# EAGLE design MISTERCRT_Final (EAGLE 9.6.2)
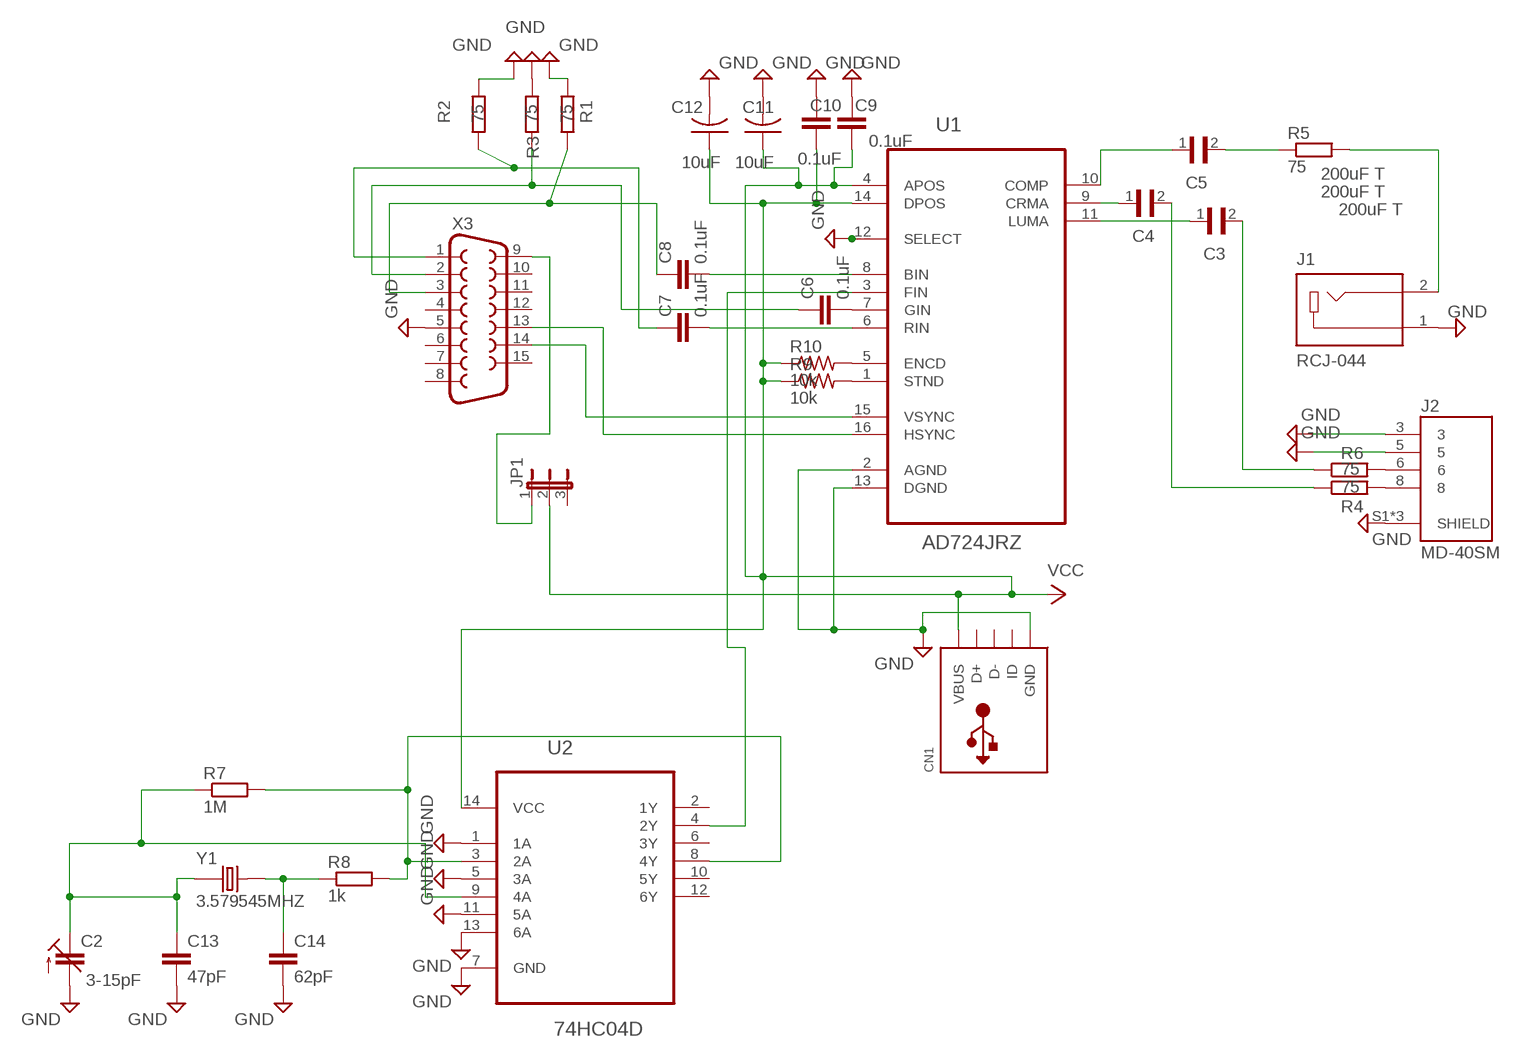
[diagram p0: schematic, sheet 1]

## Parts
C2  3-15pF  C-TRIMM3018_11  [CTRIM3018_11]
C3  200uF T  T491X106K050AT  [CAPMP7343X430N]
C4  200uF T  T491X106K050AT  [CAPMP7343X430N]
C5  200uF T  T491X106K050AT  [CAPMP7343X430N]
C6  0.1uF  C-EUC0805  [C0805]
C7  0.1uF  C-EUC0805  [C0805]
C8  0.1uF  C-EUC0805  [C0805]
C9  0.1uF  C-EUC0805  [C0805]
C10  0.1uF  C-EUC0805  [C0805]
C11  10uF  C-USC1206K  [C1206K]
C12  10uF  C-USC1206K  [C1206K]
C13  47pF  C-EUC0805  [C0805]
C14  62pF  C-EUC0805  [C0805]
CN1  USBMINIB  [USB-MINIB]
J1  RCJ-044  [CUI_RCJ-044]
J2  MD-40SM  [CUI_MD-40SM]
JP1  JP2W  [JP2W]
R1  75  R-EU_M0805  [M0805]
R2  75  R-EU_M0805  [M0805]
R3  75  R-EU_M0805  [M0805]
R4  75  R-EU_M0805  [M0805]
R5  75  R-EU_M0805  [M0805]
R6  75  R-EU_M0805  [M0805]
R7  1M  R-EU_R2512  [R2512]
R8  1k  R-EU_R0805  [R0805]
R9  10k  R-US_R0805  [R0805]
R10  10k  R-US_R0805  [R0805]
U1  AD724JRZ  [SOIC127P1032X265-16N]
U2  74HC04D  [SOIC127P600X175-14N]
X3  F15HDH  [HDF15H]
Y1  3.579545MHZ  ECS-35-17-18-TR  [XTAL_ECS-35-17-18-TR]

## Nets
GND: C2.-(A) C9.2 C10.2 C11.2 C12.2 C13.2 C14.2 CN1.GND J1.1 J2.3 J2.5 J2.S1(SHIELD) J2.S2(SHIELD) J2.S3(SHIELD) R1.2 R2.2 R3.2 U1.2(AGND) U1.12(SELECT) U1.13(DGND) U2.1(1A) U2.5(3A) U2.7(GND) U2.11(5A) U2.13(6A) X3.5
N$1: C2.+(E) C13.1 R7.1 U2.9(4A) Y1.1 Y1.4
N$2: R10.2 U1.5(ENCD)
N$3: U1.3(FIN) U2.4(2Y)
N$4: C7.1 R2.1 X3.1
N$5: C6.1 R3.1 X3.2
N$6: C8.1 R1.1 X3.3
N$7: U1.16(HSYNC) X3.13
N$8: U1.15(VSYNC) X3.14
N$9: J2.6 R6.2
N$10: J2.8 R4.2
N$11: C3.2 R6.1
N$12: C3.1 U1.11(LUMA)
N$13: C4.2 R4.1
N$14: C4.1 U1.9(CRMA)
N$15: C5.1 U1.10(COMP)
N$16: C5.2 R5.1
N$17: J1.2 R5.2
N$18: JP1.1 X3.9
N$19: C6.2 U1.7(GIN)
N$20: C7.2 U1.6(RIN)
N$21: C8.2 U1.8(BIN)
N$22: C14.1 R8.1 Y1.2 Y1.3
N$24: R7.2 R8.2 U2.3(2A) U2.8(4Y)
N$39: R9.2 U1.1(STND)
VCC: C9.1 C10.1 C11.1 C12.1 CN1.VBUS JP1.2 R9.1 R10.1 U1.4(APOS) U1.14(DPOS) U2.14(VCC)
Unconnected: CN1.D+ CN1.D- CN1.ID JP1.3 U2.2(1Y) U2.6(3Y) U2.10(5Y) U2.12(6Y) X3.4 X3.6 X3.7 X3.8 X3.10 X3.11 X3.12 X3.15

## Library data of the parts
C2 = rcl:C-TRIMM: Trimm capacitor
C3-C5 = T491X106K050AT:T491X106K050AT: SURFACE MOUNT TANTALUM Check prices <https://pricing.snapeda.com/parts/T491X106K050AT/KEMET/view-part?ref=eda>; AVAILABILITY: In Stock; DESCRIPTION: 10µF Molded Tantalum Capacitors 50V 2917 (7343 Metric) 700mOhm; MF: KEMET; MP: T491X106K050AT; PACKAGE: 2917 Kemet; PRICE: None
C6-C10 C13 C14 = rcl:C-EU: CAPACITOR, European symbol; SPICEPREFIX: C
C11 C12 = rcl:C-US: CAPACITOR, American symbol; SPICEPREFIX: C
CN1 = adafruit:USB: USB Connectors USBMINIB - Surface Mount Female Mini-B USB Connector 4UConnector: 06564 By microbuilder.eu Thru-hole RA Female Mini-B USB Connector 4UConnector: 18732 By ladyada.net
J1 = RCJ-044:RCJ-044: Metal Right-Angle, RCA Jack, Yellow Housing and Insulation; MANUFACTURER: CUI Devices; MAXIMUM_PACKAGE_HEIGHT: 11.6 mm; PARTREV: 1.02; STANDARD: Manufacturer Recommendations
J2 = MD-40SM:MD-40SM: 3~9 Positions, Receptacle, Right Angle, Through Hole, Shielded, Mini Circular DIN Connector; MANUFACTURER: CUI Devices; MAXIMUM_PACKAGE_HEIGHT: 13.05 mm; PARTREV: 1.05; STANDARD: Manufacturer Recommendation
JP1 = jumper:JP2W: JUMPER
R1-R7 = rcl:R-EU_: RESISTOR, European symbol
R8 = rcl:R-EU_: RESISTOR, European symbol; SPICEPREFIX: R
R9 R10 = rcl:R-US_: RESISTOR, American symbol; SPICEPREFIX: R
U1 = AD724JRZ:AD724JRZ: RGB to NTSC/PAL Encoder; DESCRIPTION: Video Encoder IC RGB to NTSC/PAL 16-SOIC; DIGI-KEY_PART_NUMBER: AD724JRZ-ND; MF: Analog Devices; MP: AD724JRZ; PACKAGE: SOIC -16 Analog Devices
U2 = 74HC04D:74HC04D: Hex inverter Check prices <https://pricing.snapeda.com/parts/74HC04D/Toshiba/view-part?ref=eda>; AVAILABILITY: Not in stock; DESCRIPTION: Inverter IC 6 Channel 14-SOIC; MF: Toshiba; MP: 74HC04D; PACKAGE: SOIC-14 NXP Semiconductors; PRICE: None
X3 = adafruit:F15: SUB-D HDH is also known as a 'right angle VGA' connector
Y1 = ECS-35-17-18-TR:ECS-35-17-18-TR: Crystal Series 4-SMD, No Lead; DESCRIPTION: 3.579545MHz ±30ppm Crystal 17pF 200 Ohms 4-SMD, No Lead; DIGI-KEY_PART_NUMBER: XC584CT-ND; MF: ECS Inc.; MP: ECS-35-17-18-TR; PACKAGE: SMD-4 ECS International

## Board
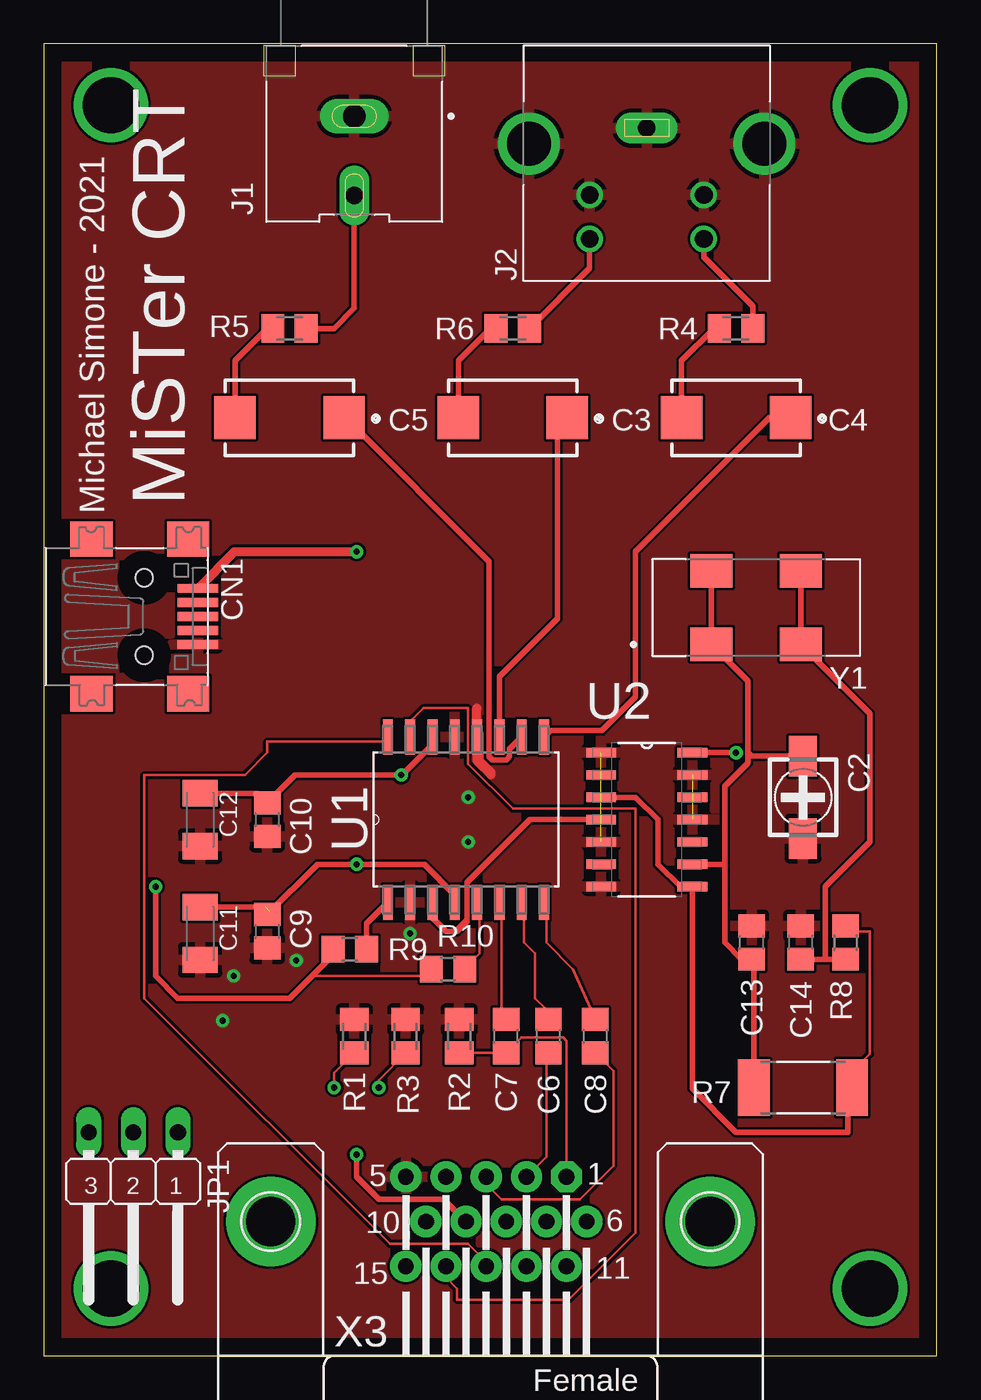
[diagram p1: board, top side]
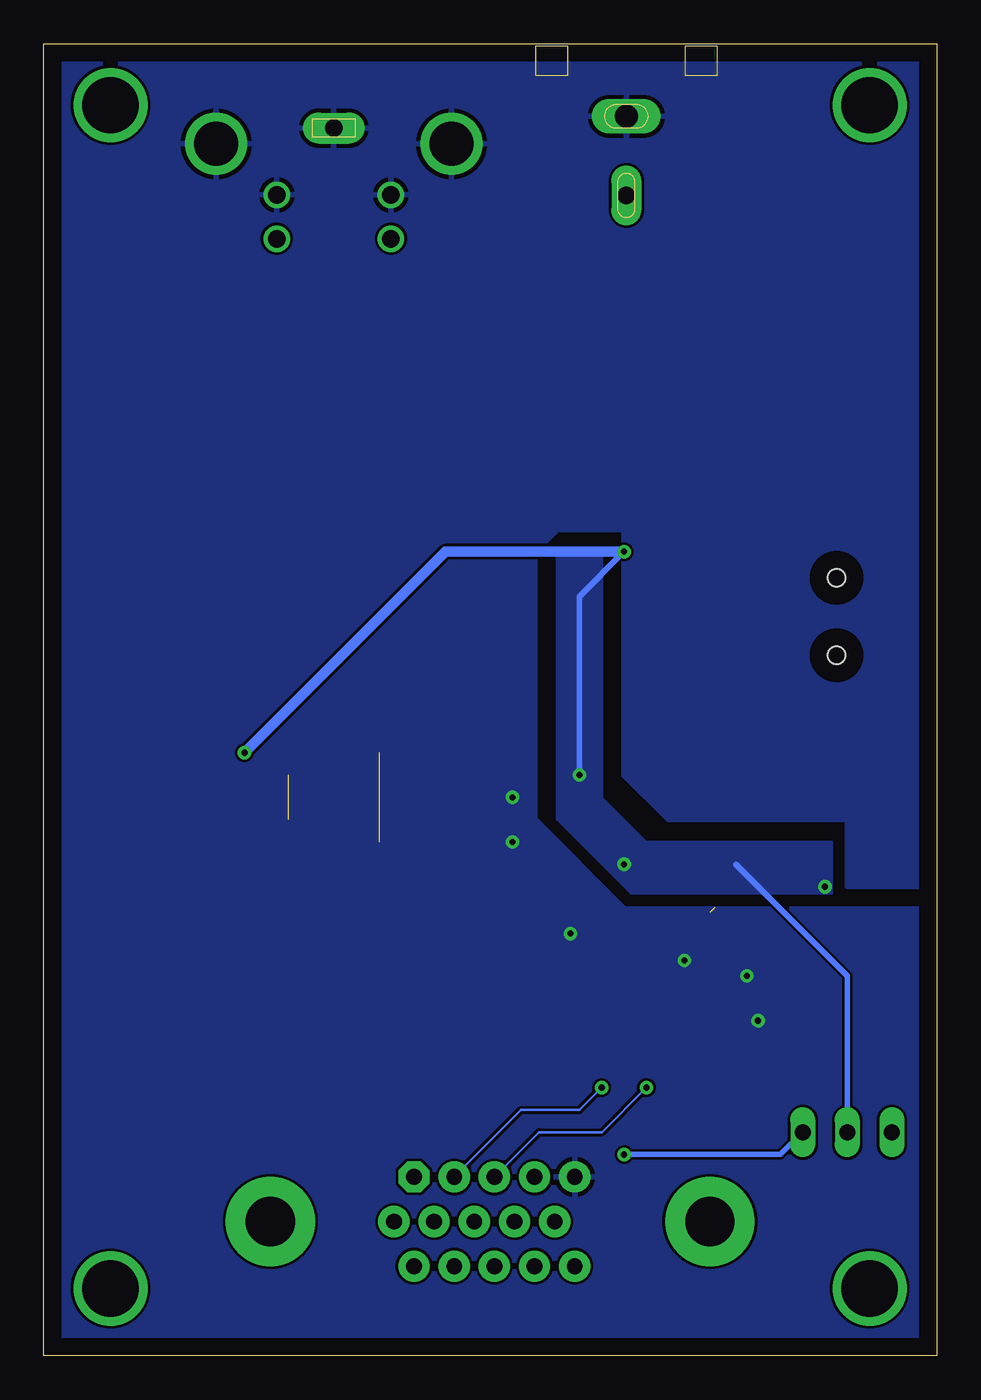
[diagram p2: board, bottom side, seen from below]

Size 50.78 x 74.6 mm. Coordinates in mm from the lower left corner, seen from the top.
Outline: 0,0 50.78,0 50.78,74.6 0,74.6 0,0
Copper layers (1*16): Top 0.035mm / dielectric 1.5mm / Bottom 0.035mm
Design rules "default": minimum track width 6mil, minimum drill 0.35mm, track to track 6mil, track to pad 6mil, pad to pad 6mil, via to via 6mil, smd to smd 6mil, copper to edge 40mil, drill to drill 6mil, minimum pad ring 10mil, minimum via ring 8mil, stop-mask expansion 4mil, vias tented up to drill 0mil, thermal gap 10mil

### Footprints (pad centres in the part's own frame; a part is rotated, then mirrored left to right if it is on the bottom)
CTRIM3018_11 = smd 2.3 x 1.6: + -2.35,0; - 2.35,0
CAPMP7343X430N = smd 2.35 x 2.45: 1 -3.1,0; 2 3.1,0
C0805 = smd 1.3 x 1.5: 1 -0.95,0; 2 0.95,0
C1206K = smd 1.5 x 2: 1 -1.5,0; 2 1.5,0
USB-MINIB = smd 0.5 x 2.308: D+ 0,4.064; D- -0.8,4.064; GND 1.6,4.064; ID 0.8,4.064; VBUS -1.6,4.064 | smd 2 x 2.4: GND1 -4.4,-2; GND2 -4.4,3.5; GND3 4.4,3.5; GND4 4.4,-2 | hole 1: -2.2,1; 2.2,1
CUI_RCJ-044 = drill 1.3 long: 1 0,0 | drill 1 pad 1.7 long: 2 -4.5,0
CUI_MD-40SM = drill 1: 3 -3.25,1.8; 5 3.25,1.8; 6 3.25,4.3; 8 -3.25,4.3 | drill 2.5: S1 6.7,-1.1; S2 -6.7,-1.1 | drill 1 pad 1.75 long: S3 0,-2
JP2W = drill 0.914 long: 1 -2.54,-1.27; 2 0,-1.27; 3 2.54,-1.27
M0805 = smd 1.3 x 1.6: 1 -0.95,0; 2 0.95,0
R2512 = smd 1.8 x 3.2: 1 -2.8,0; 2 2.8,0
R0805 = smd 1.3 x 1.5: 1 -0.95,0; 2 0.95,0
SOIC127P1032X265-16N = smd 1.981 x 0.559: 1 -4.699,4.445; 2 -4.699,3.175; 3 -4.699,1.905; 4 -4.699,0.635; 5 -4.699,-0.635; 6 -4.699,-1.905; 7 -4.699,-3.175; 8 -4.699,-4.445; 9 4.699,-4.445; 10 4.699,-3.175; 11 4.699,-1.905; 12 4.699,-0.635; 13 4.699,0.635; 14 4.699,1.905; 15 4.699,3.175; 16 4.699,4.445
SOIC127P600X175-14N = smd 1.702 x 0.533: 1 -2.591,3.81; 2 -2.591,2.54; 3 -2.591,1.27; 4 -2.591,0; 5 -2.591,-1.27; 6 -2.591,-2.54; 7 -2.591,-3.81; 8 2.591,-3.81; 9 2.591,-2.54; 10 2.591,-1.27; 11 2.591,0; 12 2.591,1.27; 13 2.591,2.54; 14 2.591,3.81
HDF15H = drill 0.9 pad 1.778 octagon: 1 4.329,2.54 | drill 0.9 pad 1.778: 2 2.043,2.54; 3 -0.243,2.54; 4 -2.529,2.54; 5 -4.815,2.54; 6 5.472,0; 7 3.186,0; 8 0.9,0; 9 -1.386,0; 10 -3.672,0; 11 4.329,-2.54; 12 2.043,-2.54; 13 -0.243,-2.54; 14 -2.529,-2.54; 15 -4.815,-2.54 | drill 2.8 pad 5.08: P$1 -12.5,0; P$2 12.5,0
XTAL_ECS-35-17-18-TR = smd 2.4 x 1.9: 1 -2.54,-2.1; 2 2.54,-2.1; 3 2.54,2.1; 4 -2.54,2.1

### Placement (x,y rotation side)
C2  43.18,31.75 270 top
C3  26.67,53.34 180 top
C4  39.37,53.34 180 top
C5  13.97,53.34 180 top
C6  28.7,18.16 90 top
C7  26.29,18.16 90 top
C8  31.37,18.16 90 top
C9  12.7,24.13 270 top
C10  12.7,30.48 270 top
C11  8.89,24 270 top
C12  8.89,30.48 270 top
C13  40.26,23.5 90 top
C14  43.05,23.5 90 top
CN1  4.7,42.04 270 top
J1  17.65,70.48 90 top
J2  34.29,67.82 180 top
JP1  5.08,11.43 180 top
R1  17.65,18.16 90 top
R2  23.62,18.16 90 top
R3  20.57,18.16 90 top
R4  39.37,58.42 0 top
R5  13.97,58.42 0 top
R6  26.67,58.42 0 top
R7  43.18,15.24 0 top
R8  45.59,23.5 90 top
R9  17.4,23.11 0 top
R10  22.99,21.97 0 top
U1  24,30.48 90 top
U2  34.29,30.48 0 top
X3  25.4,7.62 0 top
Y1  40.51,42.55 0 top

### Tracks (layer width: path | path; a pad name or v marks a point on that pad's centre or on a via)
GND  (via drill 0.35)  (2 unrouted)
  Top 0.152: 24.7,35.37 24.77,35.56 | 31.75,34.29 U2.1 31.75,34.29
  Top 0.508: 24.7,35.37 24.77,35.31 24.77,33.83 25.42,33.17 25.42,33.04 24.64,33.83 U1.12 24.61,35.2 24.61,36.83
  other vias: 24.13,31.75 24.13,29.21 20.83,24 10.79,21.59 14.35,22.48 10.16,19.05
  pour Top: 0,74.93 50.8,74.93 50.8,0 0,0
  pour Bottom: 0,74.93 50.8,74.93 50.8,0 0,0 0,25.4 17.78,25.4 22.86,30.48 22.86,45.72 21.59,46.99 17.78,46.99 17.78,33.02 15.24,30.48 5.08,30.48 5.08,26.67 0,26.67
N$1
  Top 0.152: 40.33,22.49 C13.1 | 38.1,45.09 Y1.4
  Top 0.305: C13.1 39.68,22.55 38.73,23.5 38.73,27.94 | U2.9 38.73,27.94 | 38.73,27.94 38.73,32.38 40.05,33.7 40.05,34.29 | 40.05,34.29 40.05,38.37 Y1.1 Y1.4 | R7.1 40.38,22.43 40.33,22.49 | C2.+ 40.24,34.1 40.05,34.29
N$2
  Top 0.152: R10.2 24.13,22.23 24.77,22.86 24.77,25.4 U1.5
N$3
  Top 0.152: 24.13,26.67 24.13,24.77 23.5,24.13
  Top 0.305: U1.3 22.1,24.89 22.86,24.13 23.5,24.13 | 23.5,24.13 24.05,24.69 24.05,24.77 | 23.5,24.13 23.5,24.21 24.05,24.77 24.05,25.4 24.05,26.67 24.05,26.9 27.64,30.48 U2.4
N$4
  Top 0.152: 26.04,17.14 C7.1 | X3.1 29.73,17.91 29.55,18.09 27.17,18.09 C7.1 | C7.1 R2.1
N$5  (via drill 0.35)
  Top 0.152: R3.1 20.61,17.18 | C6.1 28.57,17.14 28.57,11.29 X3.2 | 20.96,17.14 R3.1 | R3.1 19.05,15.69 v19.05,15.24
  Bottom 0.152: X3.2 23.63,13.97 20.32,13.97 v19.05,15.24
N$6  (via drill 0.35)
  Top 0.152: C8.1 32.38,16.2 32.38,10.79 30.48,8.89 26.04,8.89 25.4,9.53 25.4,10.16 X3.3 | 17.78,17.14 R1.1 16.51,16.07 v16.51,15.24
  Bottom 0.152: X3.3 22.62,12.7 19.05,12.7 v16.51,15.24
N$7
  Top 0.152: 19.68,35.56 U1.16 19.68,34.92 12.7,34.92 12.7,34.29 11.43,33.02 5.71,33.02 5.71,20.32 19.68,6.35 24.13,6.35 24.77,5.71 24.77,5.08 X3.13
N$8
  Top 0.152: U1.15 20.96,35.56 20.96,36.2 21.59,36.83 24.13,36.83 24.13,33.66 26.67,31.11 33.65,31.11 33.65,6.99 29.84,3.17 23.5,3.17 23.5,3.81 22.86,4.45 X3.14
N$9
  Top 0.305: R6.2 31.04,61.84 J2.6
N$10
  Top 0.305: R4.2 40.32,59.69 37.54,62.47 J2.8
N$11
  Top 0.152: 25.4,58.42 R6.1
  Top 0.305: C3.2 23.57,56.59 25.4,58.42
N$12
  Top 0.152: 29.21,52.07 29.21,53.34 C3.1
  Top 0.305: U1.11 25.91,38.61 29.21,41.91 29.21,53.34
N$13
  Top 0.152: 38.1,58.42 R4.1
  Top 0.305: C4.2 36.27,56.59 38.1,58.42
N$14
  Top 0.305: U1.9 28.83,35.56 31.75,35.56 33.65,37.47 33.65,45.72 41.27,53.34 C4.1
N$15
  Top 0.152: 17.14,52.7 17.14,53.34 C5.1 | 27.3,34.92 U1.10
  Top 0.305: 17.14,53.34 25.32,45.16 25.32,34.06 25.5,33.88 26.31,33.88 26.49,34.06 26.49,34.49 U1.10
N$16
  Top 0.152: 12.7,58.42 R5.1
  Top 0.305: C5.2 10.87,56.59 12.7,58.42
N$17
  Top 0.305: R5.2 16.51,58.42 17.65,59.56 J1.2
N$18  (via drill 0.35)
  Top 0.305: X3.9 22.74,8.89 19.05,8.89 17.78,10.16 v17.78,11.43
  Bottom 0.305: v17.78,11.43 8.89,11.43 JP1.1
N$19
  Top 0.152: C6.2 28.57,19.68 27.94,20.32 27.94,22.86 27.3,23.5 27.3,25.4 U1.7
N$20
  Top 0.152: C7.2 26.04,19.68 26.04,25.4 U1.6
N$21
  Top 0.152: C8.2 30.11,21.96 28.57,23.5 28.57,25.4 U1.8
N$22
  Top 0.152: 43.18,22.86 C14.1 | 45.08,22.86 R8.1 | 42.54,40.01 Y1.2
  Top 0.305: C14.1 44.45,22.55 | 44.45,22.55 R8.1 | 44.45,22.55 44.45,26.67 46.99,29.21 46.99,36.51 Y1.2 Y1.3
N$23  (via drill 3.2 pad 3.56)
  other vias: 46.99,3.81
N$24
  Top 0.152: R8.2 45.72,24.13 46.99,24.13 46.99,17.14 46.35,16.51 46.35,15.24 R7.2
  Top 0.305: R7.2 45.72,14.98 45.72,12.7 39.37,12.7 36.88,15.19 U2.8 36.2,26.67 34.92,27.94 34.92,30.48 33.65,31.75 U2.3
N$25  (via drill 3.2 pad 3.56)
  other vias: 3.81,3.81
N$26  (via drill 3.2 pad 3.56)
  other vias: 3.81,71.12
N$27  (via drill 3.2 pad 3.56)
  other vias: 46.99,71.12
N$39
  Top 0.305: U1.1 18.35,24.57 R9.2
VCC  (via drill 0.35)  (1 unrouted)
  Top 0.152: 15.24,21.59 21.59,21.59 R10.1
  Top 0.305: v39.37,34.29 U2.14 | 12.86,25.24 C9.1 15.56,27.94 v17.78,27.94 21.64,27.94 23.37,26.21 U1.4 | C11.1 12.6,25.5 | C12.1 12.15,31.98 C10.1 14.29,33.02 v20.32,33.02 20.37,33.02 22.1,34.75 U1.14 | R9.1 16.45,22.8 15.24,21.59 13.97,20.32 7.62,20.32 6.35,21.59 v6.35,26.67
  Top 0.508: CN1.VBUS 10.85,45.72 v17.78,45.72
  Bottom 0.305: v17.78,45.72 20.32,43.18 20.32,36.83 v20.32,33.02 | JP1.2 5.08,21.59 11.43,27.94
  Bottom 0.61: v17.78,45.72 27.94,45.72 v39.37,34.29
  pour Bottom: 19.05,45.72 19.05,31.75 16.51,29.21 5.97,29.21 5.97,26.29 17.4,26.29 21.59,30.48 21.59,45.72

### Text on the board
tNames: Michael Simone - 2021 | MiSTer CRT